# EAGLE schematic ToolChanger_ConnexionBoard (EAGLE 9.2.1)
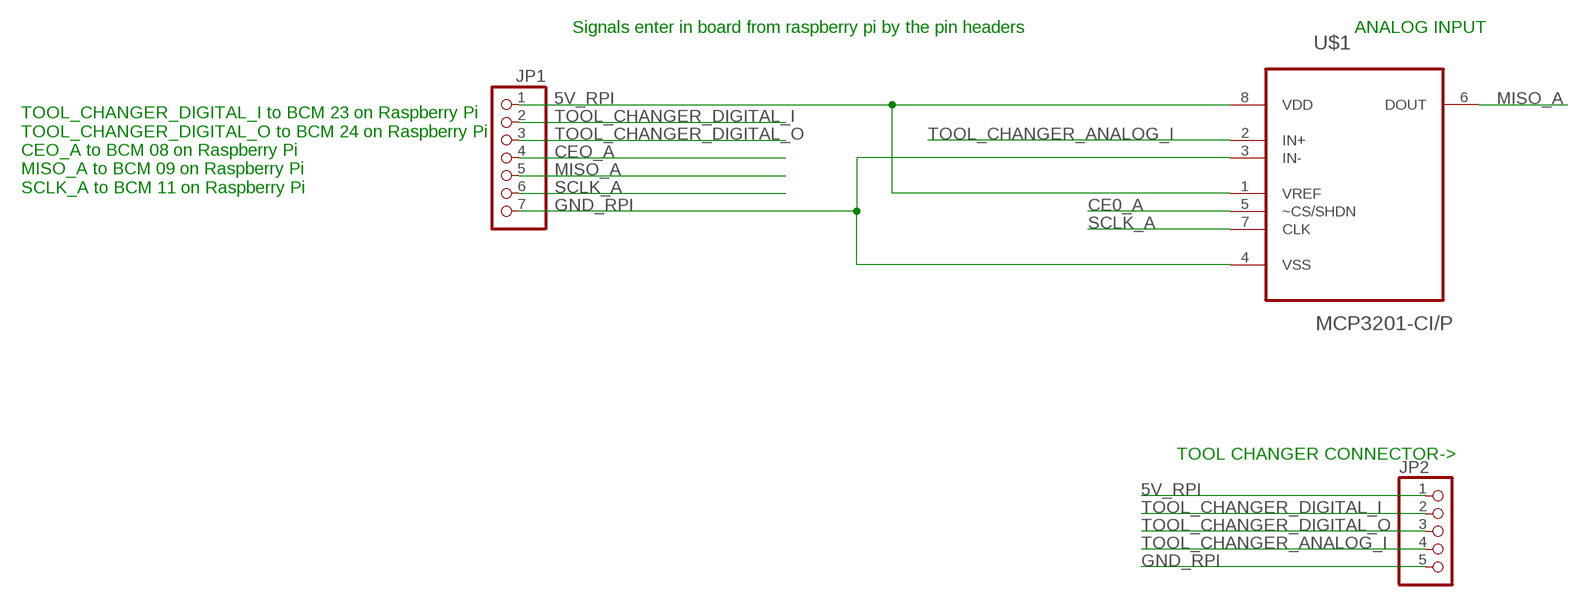
[diagram p0: schematic, sheet 1]

## Parts
JP1  PINHD-1X7  [1X07]
JP2  PINHD-1X5  [1X05]
U$1  MCP3201-CI/P  [DIP254P762X533-8]

## Nets
5V_RPI: JP1.1 JP2.1 U$1.1(VREF) U$1.8(VDD)
CE0_A: U$1.5(~CS/SHDN)
CEO_A: JP1.4
GND_RPI: JP1.7 JP2.5 U$1.3(IN-) U$1.4(VSS)
MISO_A: JP1.5 U$1.6(DOUT)
SCLK_A: JP1.6 U$1.7(CLK)
TOOL_CHANGER_ANALOG_I: JP2.4 U$1.2(IN+)
TOOL_CHANGER_DIGITAL_I: JP1.2 JP2.2
TOOL_CHANGER_DIGITAL_O: JP1.3 JP2.3

## Notes on the sheet
- Signals enter in board from raspberry pi by the pin headers | ANALOG INPUT
- TOOL_CHANGER_DIGITAL_I to BCM 23 on Raspberry Pi
  TOOL_CHANGER_DIGITAL_O to BCM 24 on Raspberry Pi
  CEO_A to BCM 08 on Raspberry Pi
  MISO_A to BCM 09 on Raspberry Pi
  SCLK_A to BCM 11 on Raspberry Pi
- TOOL CHANGER CONNECTOR->

## Library data of the parts
JP1 = pinhead:PINHD-1X7: PIN HEADER
JP2 = pinhead:PINHD-1X5: PIN HEADER
U$1 = MCP3201-CI_P:MCP3201-CI/P: A/D Converter; AVAILABILITY: Unavailable; DESCRIPTION: Single Channel SPI Serial Interface 2.7 V 12-Bit A/D Converter - PDIP-8; MF: Microchip; MP: MCP3201-CI/P; PACKAGE: DIP-8 Microchip; PRICE: None